# EAGLE design prepsu1 (EAGLE 5.07)
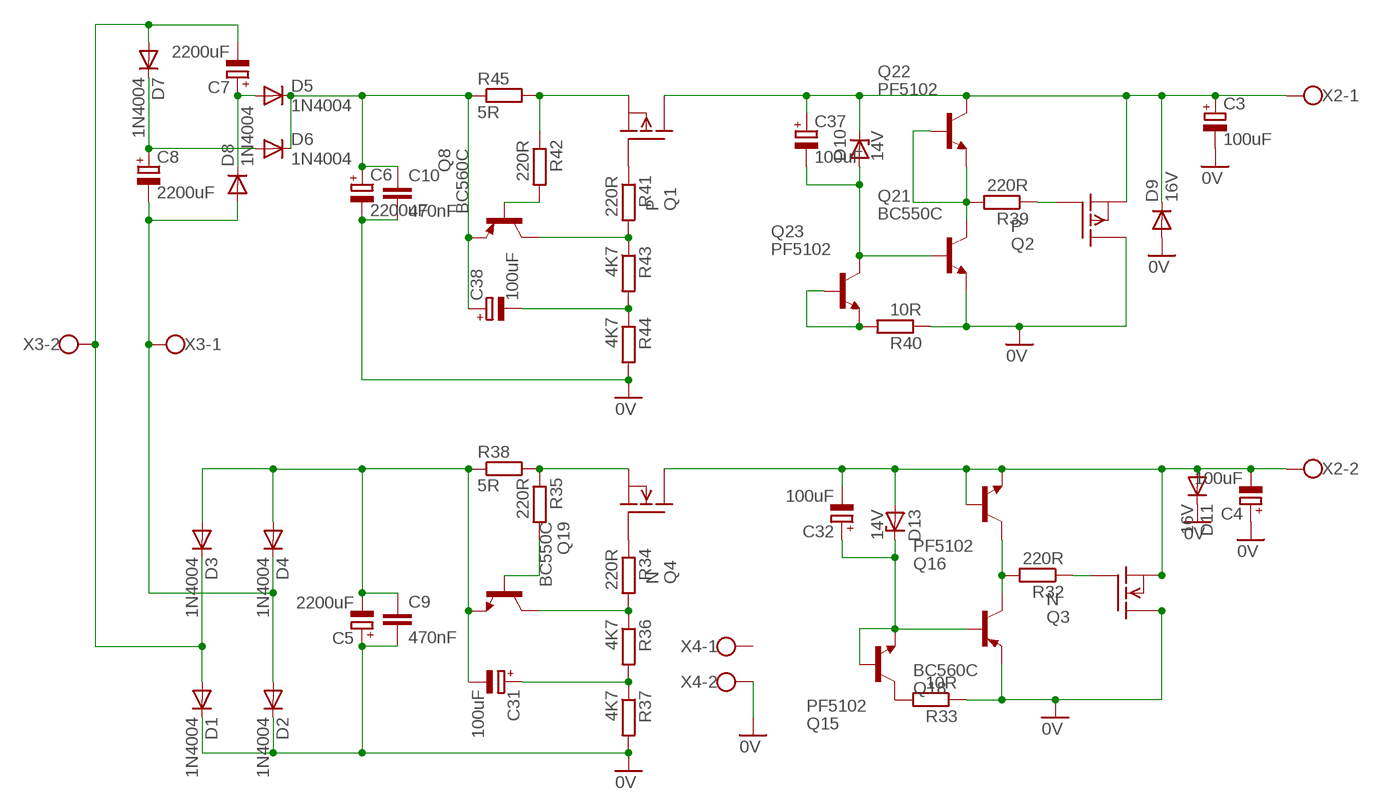
[diagram p0: schematic, sheet 1]

## Parts
C3  100uF  CPOL-EUE7.5-16  [E7,5-16]
C4  100uF  CPOL-EUE7.5-16  [E7,5-16]
C5  2200uF  CPOL-EUE10-20  [EB20D]
C6  2200uF  CPOL-EUE10-20  [EB20D]
C7  2200uF  CPOL-EUE10-20  [EB20D]
C8  2200uF  CPOL-EUE10-20  [EB20D]
C9  470nF  C-EU075-032X103  [C075-032X103]
C10  470nF  C-EU075-032X103  [C075-032X103]
C31  100uF  CPOL-EUTAP5-80  [TAP5-80]
C32  100uF  CPOL-EUTAP5-80  [TAP5-80]
C37  100uF  CPOL-EUTAP5-80  [TAP5-80]
C38  100uF  CPOL-EUTAP5-80  [TAP5-80]
D1  1N4004  [DO41-10]
D2  1N4004  [DO41-10]
D3  1N4004  [DO41-10]
D4  1N4004  [DO41-10]
D5  1N4004  [DO41-10]
D6  1N4004  [DO41-10]
D7  1N4004  [DO41-10]
D8  1N4004  [DO41-10]
D9  16V  BAS15  [DO34-7]
D10  14V  1N821  [DO35Z10]
D11  16V  BAS15  [DO34-7]
D13  14V  1N821  [DO35Z10]
Q1  P  BUZ171  [TO220]
Q2  P  BUZ171  [TO220]
Q3  N  BUZ10  [TO220]
Q4  N  BUZ10  [TO220]
Q8  BC560C  [TO92-EBC]
Q15  PF5102  BC550B  [TO92-EBC]
Q16  PF5102  BC550B  [TO92-EBC]
Q18  BC560C  [TO92-EBC]
Q19  BC550C  BC550B  [TO92-EBC]
Q21  BC550C  BC550B  [TO92-EBC]
Q22  PF5102  BC550B  [TO92-EBC]
Q23  PF5102  BC550B  [TO92-EBC]
R32  220R  R-EU_0204/7  [0204/7]
R33  10R  R-EU_0204/7  [0204/7]
R34  220R  R-EU_0204/7  [0204/7]
R35  220R  R-EU_0204/7  [0204/7]
R36  4K7  R-EU_0204/7  [0204/7]
R37  4K7  R-EU_0207/10  [0207/10]
R38  5R  R-EU_0414/15  [0414/15]
R39  220R  R-EU_0207/10  [0207/10]
R40  10R  R-EU_0204/7  [0204/7]
R41  220R  R-EU_0204/7  [0204/7]
R42  220R  R-EU_0204/7  [0204/7]
R43  4K7  R-EU_0204/7  [0204/7]
R44  4K7  R-EU_0207/10  [0207/10]
R45  5R  R-EU_0414/15  [0414/15]
X2  W237-02P  [W237-132]
X3  W237-02P  [W237-132]
X4  W237-02P  [W237-132]

## Nets
0V: C3.- C4.+ C5.+ C6.- C9.2 C10.2 D1.C D2.C D9.A D11.C Q2.2(D) Q3.2(D) Q18.E Q21.E R33.1 R37.2 R40.1 R44.2 X4.2
N$1: Q1.1(G) R41.1
N$3: Q4.1(G) R34.1
N$5: C6.+ C10.1 C38.+ D5.C D6.C Q8.E R45.1
N$6: C8.+ D6.A D7.C
N$7: C7.+ D5.A D8.C
N$10: C7.- D1.A D3.C D7.A X3.2
N$11: C8.- D2.A D4.C D8.A X3.1
N$13: C4.- C32.- D11.A D13.A Q3.3(S) Q4.2(D) Q16.B Q16.E X2.2
N$35: Q8.B R42.2
N$38: C3.+ C37.+ D9.C D10.C Q1.2(D) Q2.3(S) Q22.C X2.1
N$41: Q4.3(S) R35.1 R38.2
N$54: Q19.B R35.2
N$55: Q3.1(G) R32.1
N$56: Q19.C R34.2 R36.1
N$57: Q16.C Q18.C R32.2
N$58: C32.+ D13.C Q15.B Q15.E Q18.B
N$59: Q15.C R33.2
N$60: C5.- C9.1 C31.- D3.A D4.A Q19.E R38.1
N$61: C31.+ R36.2 R37.1
N$65: Q2.1(G) R39.1
N$66: Q21.C Q22.B Q22.E R39.2
N$67: C37.- D10.A Q21.B Q23.C
N$68: Q23.B Q23.E R40.2
N$69: Q1.3(S) R42.1 R45.2
N$71: Q8.C R41.2 R43.1
N$73: C38.- R43.2 R44.1
Unconnected: X4.1

## Library data of the parts
C3-C8 C31 C32 C37 C38 = resistor:CPOL-EU: POLARIZED CAPACITOR, European symbol
C9 C10 = resistor:C-EU: CAPACITOR, European symbol
D1-D8 = diode:1N4004: DIODE general purpose rectifier, 1 A
D9 D11 = diode:BAS15: DIODE high speed
D10 D13 = diode:1N821: Reference DIODE temperature compensated, 6,2 V
Q1 Q2 = transistor-fet:BUZ171: P-Channel Enhancement MOSFET -50V; 7A; 0,4Ohm
Q3 Q4 = transistor-fet:BUZ10: N-Channel Enhancement MOSFET 50V; 20A; 0,080Ohm
Q8 Q18 = transistor-pnp:BC560*: PNP Transistror
Q15 Q16 Q19 Q21-Q23 = transistor-npn:BC550*: NPN Transistor
R32-R45 = resistor:R-EU_: RESISTOR, European symbol
X2-X4 = con-wago-508:W237-02P: WAGO SREW CLAMP

## Board
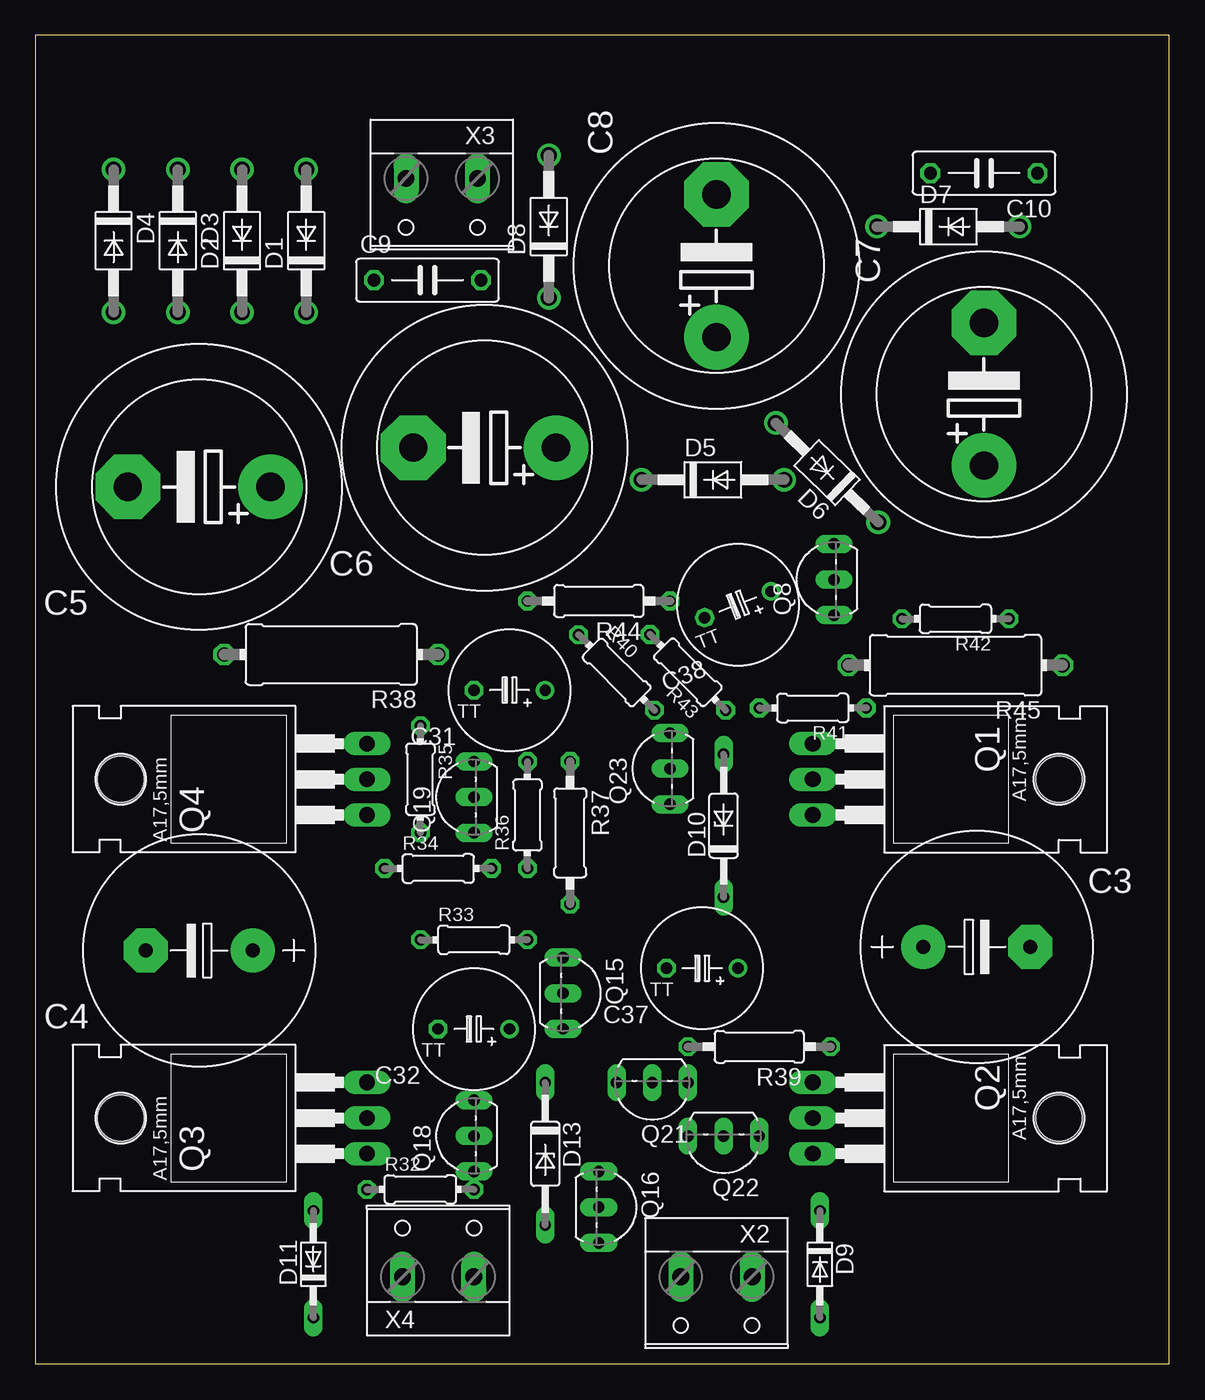
[diagram p1: board, top side]
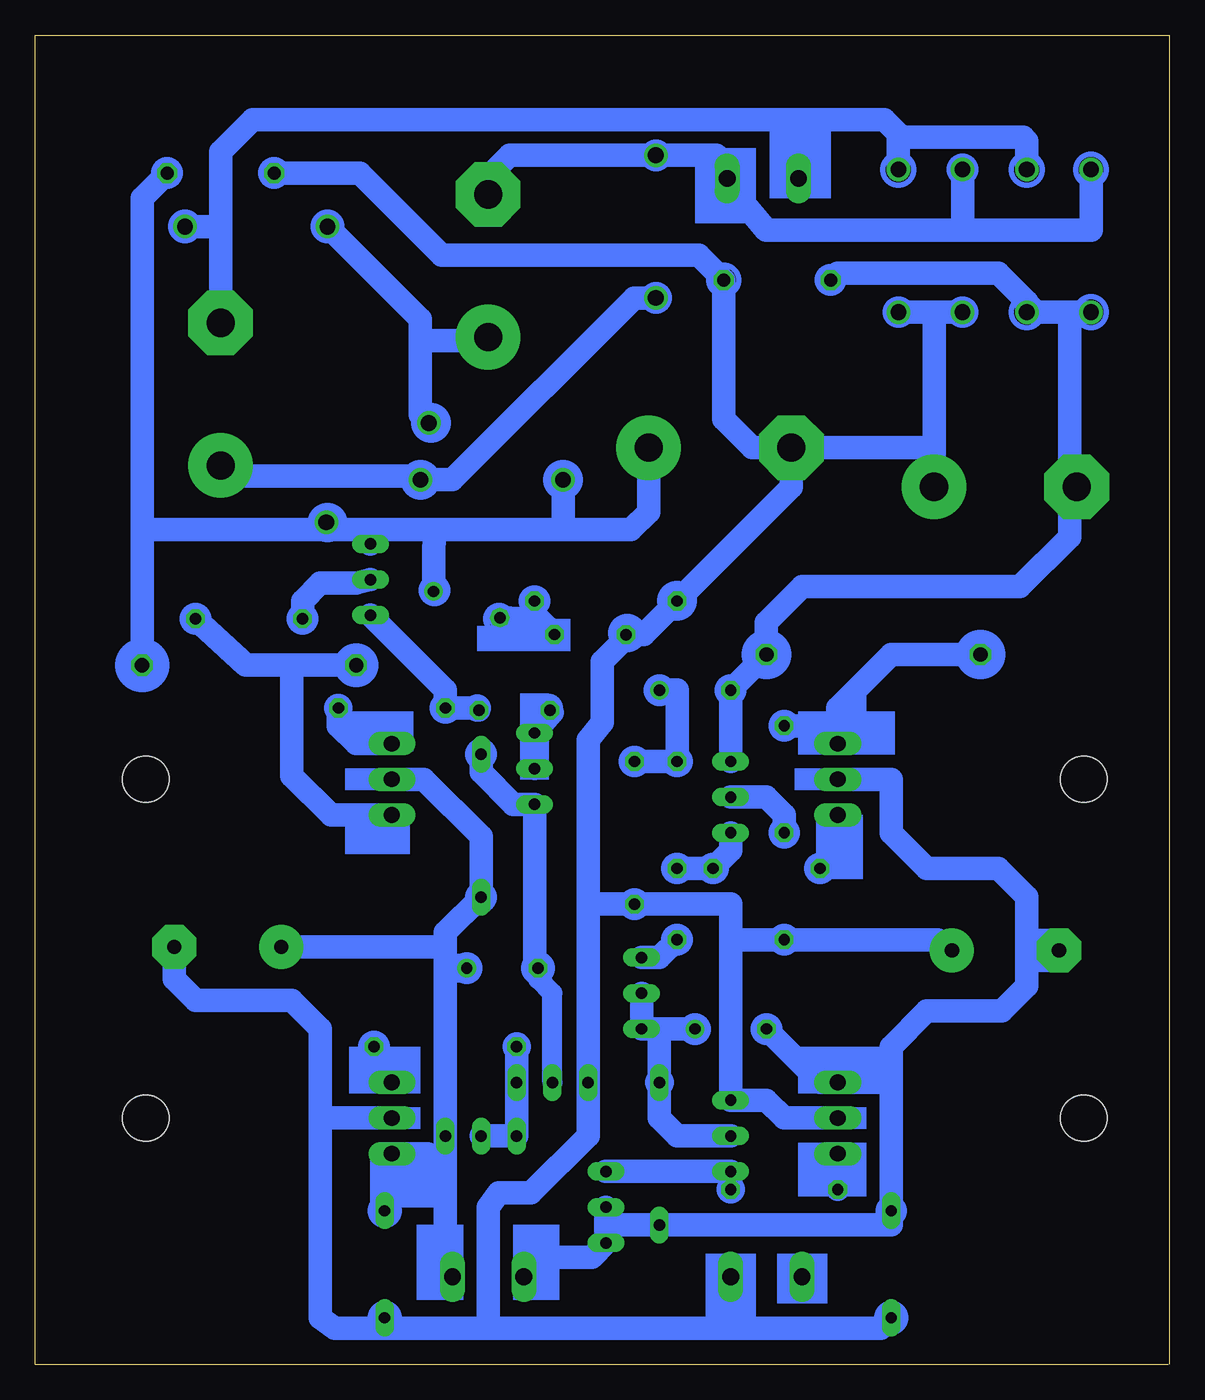
[diagram p2: board, bottom side, seen from below]

Size 80.77 x 94.69 mm. Coordinates in mm from the lower left corner, seen from the top.
Outline: 80.75,0.02 80.75,94.69 0,94.69 0,0.02
Outline: 80.77,0 0.08,0
Copper layers (1*16): Top 0.035mm / dielectric 1.5mm / Bottom 0.035mm
Design rules "default": minimum track width 10mil, minimum drill 24mil, track to track 8mil, track to pad 8mil, pad to pad 8mil, via to via 8mil, smd to smd 8mil, copper to edge 40mil, drill to drill 8mil, minimum pad ring 10mil, minimum via ring 8mil, stop-mask expansion 4mil, vias tented up to drill 0mil, thermal gap 10mil

### Footprints (pad centres in the part's own frame; a part is rotated, then mirrored left to right if it is on the bottom)
E7,5-16 = drill 1.016 pad 3.15 round: + -3.81,0 | drill 1.016 pad 3.15 octagon: - 3.81,0
EB20D = drill 2.007 pad 4.597 round: + -5.08,0 | drill 2.007 pad 4.597 octagon: - 5.08,0
C075-032X103 = drill 0.914 octagon: 1 -3.81,0; 2 3.81,0
TAP5-80 = drill 0.813 round: + -2.54,0 | drill 0.813 octagon: - 2.54,0
DO41-10 = drill 1.118 round: A 5.08,0; C -5.08,0
DO34-7 = drill 0.813 long: A 3.81,0; C -3.81,0
DO35Z10 = drill 0.813 long: A 5.08,0; C -5.08,0
TO220 = drill 1.118 long: 1 -2.54,-6.35; 2 0,-6.35; 3 2.54,-6.35 | hole 3.302: 0,11.176
TO92-EBC = drill 0.813 long: B 0,-1.27; C -2.54,-1.27; E 2.54,-1.27
0204/7 = drill 0.813 octagon: 1 -3.81,0; 2 3.81,0
0207/10 = drill 0.813 octagon: 1 -5.08,0; 2 5.08,0
0414/15 = drill 1.016 octagon: 1 -7.62,0; 2 7.62,0
W237-132 = drill 1.194 long: 1 -2.54,-0.635; 2 2.54,-0.635

### Placement (x,y rotation side)
C3  67.06,29.74 0 top
C4  11.68,29.48 180 top
C5  11.68,62.5 180 top
C6  32,65.3 180 top
C7  67.56,69.11 90 top
C8  48.51,78.25 90 top
C9  27.94,77.24 0 top
C10  67.56,84.86 180 top
C31  33.78,48.03 180 top
C32  31.24,23.9 180 top
C37  47.5,28.21 180 top
C38  50.04,54.12 201.5 top
D1  19.3,80.03 90 top
D2  14.73,80.03 90 top
D3  10.16,80.03 270 top
D4  5.59,80.03 270 top
D5  48.26,63.01 0 top
D6  56.39,63.52 135.9 top
D7  65.02,81.05 0 top
D8  36.58,81.05 90 top
D9  55.88,7.13 270 top
D10  49.02,38.37 90 top
D11  19.81,7.13 90 top
D13  36.32,15.01 270 top
Q1  61.72,41.68 270 top
Q2  61.72,17.55 270 top
Q3  17.27,17.55 90 top
Q4  17.27,41.68 90 top
Q8  55.63,55.9 90 top
Q15  38.86,26.44 270 top
Q16  41.4,11.2 270 top
Q18  29.97,16.28 90 top
Q19  29.97,40.41 90 top
Q21  43.94,18.82 180 top
Q22  49.02,15.01 180 top
Q23  43.94,42.44 90 top
R32  27.43,12.47 0 top
R33  31.24,30.25 0 top
R34  28.7,35.33 0 top
R35  27.43,41.68 270 top
R36  35.05,39.14 90 top
R37  38.1,37.87 270 top
R38  21.08,50.57 180 top
R39  51.56,22.63 180 top
R40  41.4,49.3 315.1 top
R41  55.37,46.76 180 top
R42  65.53,53.11 180 top
R43  46.48,49.3 135 top
R44  40.13,54.38 180 top
R45  65.53,49.8 180 top
X2  48.51,5.61 180 top
X3  28.96,83.84 180 top
X4  28.7,6.88 0 top

### Tracks (layer width: path | path; a pad name or v marks a point on that pad's centre or on a via)
0V
  Bottom 1.676: 31.24,30.25 Q18.E 28.7,18.82 27.43,17.55 Q3.2 | 31.24,30.25 31.24,32.79 R37.2 41.4,32.79 | 41.4,32.79 Q21.E 41.4,16.28 45.47,12.21 47.75,12.21 48.51,11.2 48.51,2.56 | 60.45,17.55 Q2.2 | C4.+ 15.75,29.48 16.51,30.25 R33.1 31.24,30.25 | 60.45,17.55 60.45,23.9 62.48,25.93 69.34,25.93 70.87,27.45 C3.- | 48.51,2.56 55.88,2.56 | 55.88,2.56 59.44,2.56 60.45,3.32 60.45,17.55 | 16.76,74.95 D2.C | 16.76,74.95 D1.C | 16.76,65.3 C5.+ | 16.76,65.3 16.76,74.95 | C6.- 16.76,65.3 | C6.- 29.72,65.3 31.75,67.33 C9.2 33.53,79.01 51.82,79.01 57.66,84.86 C10.2 | X4.2 31.24,3.58 32.26,2.56 | 48.51,2.56 32.26,2.56 | C6.- 26.92,62.5 R44.2 37.44,51.99 R40.1 38.7,51.74 40.39,50.06 40.39,45.74 41.4,44.47 41.4,32.79 | D11.C 20.57,2.56 32.26,2.56 | 55.88,2.56 D9.A
N$1
  Bottom 1.676: R41.1 59.18,45.49 57.91,44.22 Q1.1
N$3
  Bottom 1.676: Q4.1 23.62,36.6 R34.1
N$5
  Bottom 1.676: 59.94,59.46 56.9,59.46 | 73.15,59.46 59.94,59.46 | 73.15,59.46 R45.1 | 56.9,59.46 Q8.E | 56.9,59.46 52.32,59.46 | 52.32,59.46 52.4,58.01 C38.+ | 52.32,59.46 43.18,59.46 | 43.18,59.46 38.35,59.46 37.08,60.73 C6.+ | D6.C 59.94,59.89 59.94,59.46 | 43.18,59.46 D5.C | C10.1 73.15,83.08 73.15,59.46
N$6
  Bottom 1.676: C8.+ 48.77,72.92 53.34,72.92 | D7.C 53.34,74.44 53.34,72.92 | D6.A 53.34,67.66 53.34,72.92
N$7
  Bottom 1.676: D8.C 38.1,75.97 51.05,63.01 D5.A 53.59,63.27 66.55,63.27 67.31,63.27 67.56,63.52 C7.+
N$10
  Bottom 1.676: D3.C 10.16,87.14 10.41,87.4 19.3,87.4 D1.A 19.3,87.65 20.32,88.67 26.42,88.67 | 26.42,88.67 65.28,88.67 67.56,86.38 67.56,81.05 | C7.- 67.56,81.05 | 67.56,81.05 D7.A | 26.42,88.67 X3.2
N$11
  Bottom 1.676: D4.C 5.59,80.79 14.73,80.79 | 14.73,80.79 D2.A | C8.- 48.51,84.6 46.99,86.13 D8.A 32.26,86.13 31.75,85.62 31.75,84.22 X3.1 31.5,84.09 28.7,80.79 14.73,80.79
N$13
  Bottom 1.676: 40.13,9.93 Q16.E 41.15,7.64 45.34,7.64 X2.2 | 40.13,9.93 Q16.B | 40.13,9.93 D13.A 19.81,9.93 19.81,10.69 D11.A 19.81,20.09 | Q4.2 19.81,41.68 19.81,37.87 17.27,35.33 12.19,35.33 10.16,33.29 10.16,29.48 | 19.81,20.09 Q3.3 24.89,20.09 C32.- | 10.16,29.48 C4.- | 10.16,29.48 10.16,26.94 11.94,25.17 17.27,25.17 19.81,22.63 19.81,20.09
N$35
  Bottom 1.676: Q8.B 57.91,55.65 60.45,55.65 61.72,54.38 R42.2
N$38
  Bottom 1.676: Q1.2 53.09,41.68 49.02,37.61 D10.C 51.56,30.75 51.56,29.74 | X2.1 51.56,8.28 51.56,13.74 | 51.56,13.74 Q22.C 51.56,28.21 | 51.56,13.74 52.83,15.01 Q2.3 55.63,15.01 55.88,14.75 D9.C | 51.56,28.21 51.56,29.74 | 51.56,28.21 C37.+ | 51.56,29.74 C3.+
N$41
  Bottom 1.676: R38.2 19.81,50.57 23.62,46.76 23.62,45.49 | 23.62,45.49 Q4.3 | 23.62,45.49 R35.1
N$54
  Bottom 1.676: Q19.B 28.7,40.41 27.43,39.14 R35.2
N$55
  Bottom 1.676: R32.1 Q3.1
N$56
  Bottom 1.676: R36.1 R34.2 31.24,36.6 Q19.C
N$57
  Bottom 1.676: R32.2 Q18.C Q16.C
N$58
  Bottom 1.676: Q18.B 35.05,16.28 36.32,17.55 D13.C 36.32,23.9 | 36.32,23.9 C32.+ | 36.32,23.9 Q15.E Q15.B
N$59
  Bottom 1.676: R33.2 36.32,28.98 Q15.C
N$60
  Bottom 1.676: Q19.E C31.- R38.1 28.7,52.85 26.16,55.39 10.67,55.39 7.11,58.95 7.11,63.77 | 7.11,74.95 D4.A | 7.11,74.95 D3.A 10.16,75.71 12.19,77.74 23.62,77.74 C9.1 | 7.11,63.77 C5.- | 7.11,63.77 7.11,74.95
N$61
  Bottom 1.676: R37.1 R36.2 35.05,48.03 C31.+
N$65
  Bottom 1.676: Q2.1 55.37,21.36 R39.1
N$66
  Bottom 1.676: Q22.E Q22.B | Q22.E R39.2 | Q22.E Q21.C
N$67
  Bottom 1.422: Q21.B 43.94,26.44 44.96,27.45 C37.-
  Bottom 1.676: D10.A 49.02,42.18 46.74,39.9 Q23.C 45.21,28.47 C37.-
N$68
  Bottom 1.676: R40.2 43.94,46.45 Q23.E Q23.B
N$69
  Bottom 1.676: R42.1 65.79,49.8 62.48,49.8 | 62.48,49.8 R45.2 | Q1.3 59.69,39.14 62.48,41.93 62.48,49.8
N$71
  Bottom 1.676: R43.1 49.33,46.76 R41.2 51.56,48.03 Q8.C
N$73
  Bottom 1.676: R43.2 44.9,53.11 45.21,53.11 | 45.21,53.11 C38.- | 45.21,53.11 R44.1
(copper drawn outside any net)
  shapes: Bottom area x35, Bottom circle x71